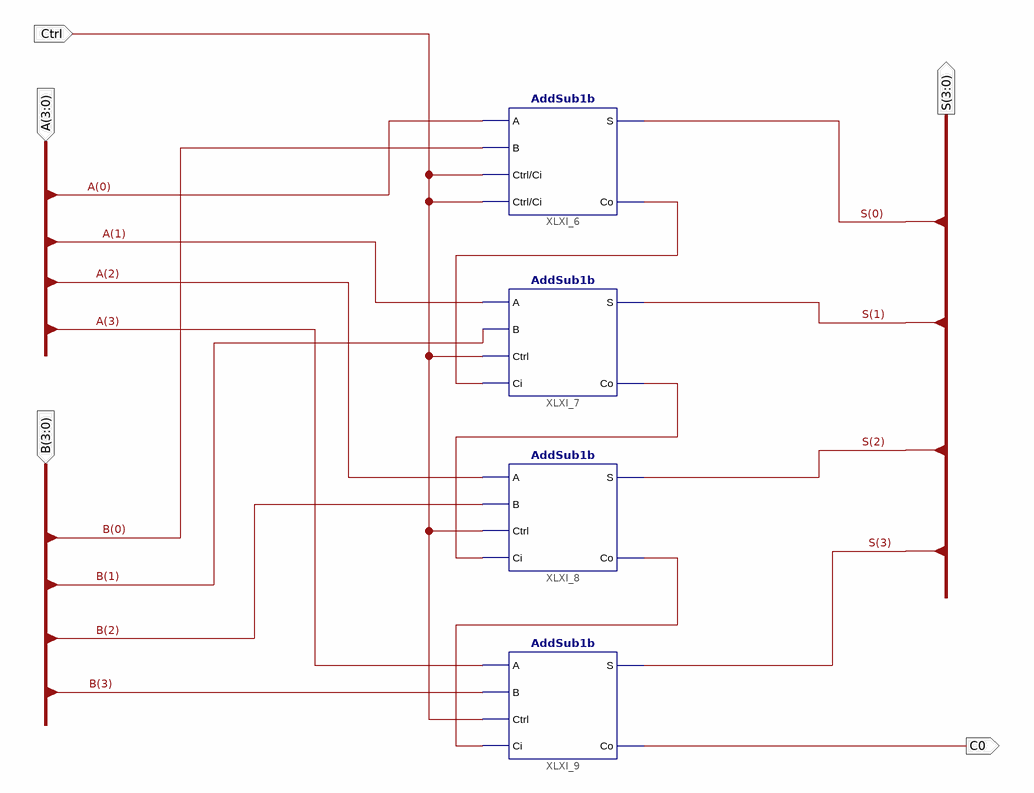
[diagram p0: schematic sheet 1]
// Xilinx ISE schematic AddSub4b.sch (kintex7) as structural Verilog: 4 symbols, 5 ports
module AddSub4b (
  input  Ctrl,
  input  [3:0] A,
  input  [3:0] B,
  output [3:0] S,
  output C0
);

  wire XLXN_41, XLXN_42, XLXN_43;

  AddSub1b XLXI_6 (.A(A[0]), .B(B[0]), .Ctrl(Ctrl), .Ci(Ctrl), .S(S[0]), .Co(XLXN_41));
  AddSub1b XLXI_7 (.A(A[1]), .B(B[1]), .Ctrl(Ctrl), .Ci(XLXN_41), .S(S[1]), .Co(XLXN_42));
  AddSub1b XLXI_8 (.A(A[2]), .B(B[2]), .Ctrl(Ctrl), .Ci(XLXN_42), .S(S[2]), .Co(XLXN_43));
  AddSub1b XLXI_9 (.A(A[3]), .B(B[3]), .Ctrl(Ctrl), .Ci(XLXN_43), .S(S[3]), .Co(C0));
endmodule
